# EAGLE design leds (EAGLE 9.4.2)
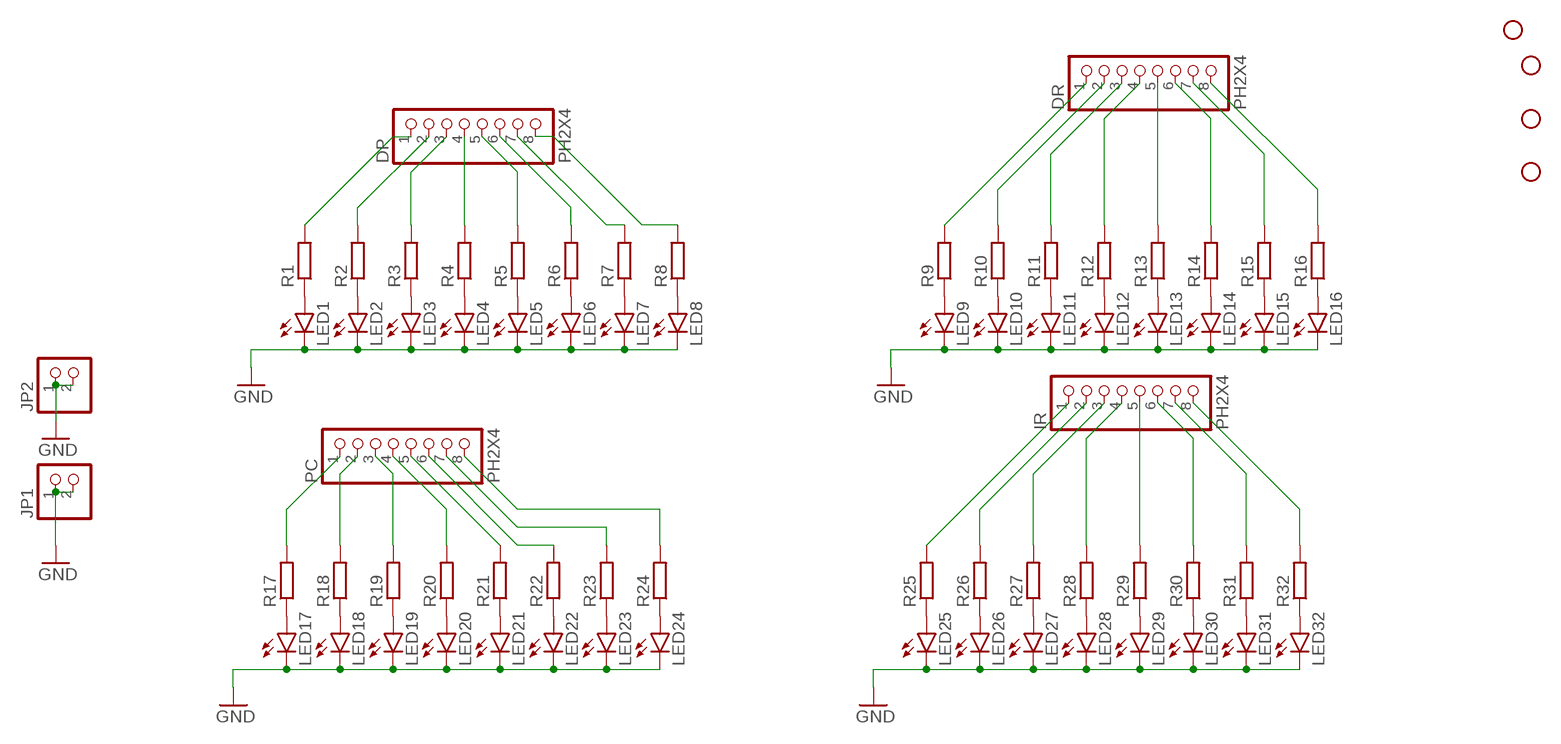
[diagram p0: schematic, sheet 1]

## Parts
DP  PH2X4  [2X04]
DR  PH2X4  [2X04]
H1  STAND-OFF  [STAND-OFF]
H2  STAND-OFF  [STAND-OFF]
H3  STAND-OFF  [STAND-OFF]
H4  STAND-OFF  [STAND-OFF]
IR  PH2X4  [2X04]
JP1  PINHD-1X2  [1X02]
JP2  PINHD-1X2  [1X02]
LED1  LED5MM  [LED5MM]
LED2  LED5MM  [LED5MM]
LED3  LED5MM  [LED5MM]
LED4  LED5MM  [LED5MM]
LED5  LED5MM  [LED5MM]
LED6  LED5MM  [LED5MM]
LED7  LED5MM  [LED5MM]
LED8  LED5MM  [LED5MM]
LED9  LED5MM  [LED5MM]
LED10  LED5MM  [LED5MM]
LED11  LED5MM  [LED5MM]
LED12  LED5MM  [LED5MM]
LED13  LED5MM  [LED5MM]
LED14  LED5MM  [LED5MM]
LED15  LED5MM  [LED5MM]
LED16  LED5MM  [LED5MM]
LED17  LED5MM  [LED5MM]
LED18  LED5MM  [LED5MM]
LED19  LED5MM  [LED5MM]
LED20  LED5MM  [LED5MM]
LED21  LED5MM  [LED5MM]
LED22  LED5MM  [LED5MM]
LED23  LED5MM  [LED5MM]
LED24  LED5MM  [LED5MM]
LED25  LED5MM  [LED5MM]
LED26  LED5MM  [LED5MM]
LED27  LED5MM  [LED5MM]
LED28  LED5MM  [LED5MM]
LED29  LED5MM  [LED5MM]
LED30  LED5MM  [LED5MM]
LED31  LED5MM  [LED5MM]
LED32  LED5MM  [LED5MM]
PC  PH2X4  [2X04]
R1  R-EU_0204/5  [0204/5]
R2  R-EU_0204/5  [0204/5]
R3  R-EU_0204/5  [0204/5]
R4  R-EU_0204/5  [0204/5]
R5  R-EU_0204/5  [0204/5]
R6  R-EU_0204/5  [0204/5]
R7  R-EU_0204/5  [0204/5]
R8  R-EU_0204/5  [0204/5]
R9  R-EU_0204/5  [0204/5]
R10  R-EU_0204/5  [0204/5]
R11  R-EU_0204/5  [0204/5]
R12  R-EU_0204/5  [0204/5]
R13  R-EU_0204/5  [0204/5]
R14  R-EU_0204/5  [0204/5]
R15  R-EU_0204/5  [0204/5]
R16  R-EU_0204/5  [0204/5]
R17  R-EU_0204/5  [0204/5]
R18  R-EU_0204/5  [0204/5]
R19  R-EU_0204/5  [0204/5]
R20  R-EU_0204/5  [0204/5]
R21  R-EU_0204/5  [0204/5]
R22  R-EU_0204/5  [0204/5]
R23  R-EU_0204/5  [0204/5]
R24  R-EU_0204/5  [0204/5]
R25  R-EU_0204/5  [0204/5]
R26  R-EU_0204/5  [0204/5]
R27  R-EU_0204/5  [0204/5]
R28  R-EU_0204/5  [0204/5]
R29  R-EU_0204/5  [0204/5]
R30  R-EU_0204/5  [0204/5]
R31  R-EU_0204/5  [0204/5]
R32  R-EU_0204/5  [0204/5]

## Nets
GND: JP1.1 JP1.2 JP2.1 JP2.2 LED1.K(C) LED2.K(C) LED3.K(C) LED4.K(C) LED5.K(C) LED6.K(C) LED7.K(C) LED8.K(C) LED9.K(C) LED10.K(C) LED11.K(C) LED12.K(C) LED13.K(C) LED14.K(C) LED15.K(C) LED16.K(C) LED17.K(C) LED18.K(C) LED19.K(C) LED20.K(C) LED21.K(C) LED22.K(C) LED23.K(C) LED24.K(C) LED25.K(C) LED26.K(C) LED27.K(C) LED28.K(C) LED29.K(C) LED30.K(C) LED31.K(C) LED32.K(C)
N$1: LED1.A R1.1
N$2: LED2.A R2.1
N$3: LED3.A R3.1
N$4: LED4.A R4.1
N$5: LED5.A R5.1
N$6: LED6.A R6.1
N$7: LED7.A R7.1
N$8: LED8.A R8.1
N$9: LED9.A R9.1
N$10: LED10.A R10.1
N$11: LED11.A R11.1
N$12: LED12.A R12.1
N$13: LED13.A R13.1
N$14: LED14.A R14.1
N$15: LED15.A R15.1
N$16: LED16.A R16.1
N$17: LED17.A R17.1
N$18: LED18.A R18.1
N$19: LED19.A R19.1
N$20: LED20.A R20.1
N$21: LED21.A R21.1
N$22: LED22.A R22.1
N$23: LED23.A R23.1
N$24: LED24.A R24.1
N$25: LED25.A R25.1
N$26: LED26.A R26.1
N$27: LED27.A R27.1
N$28: LED28.A R28.1
N$29: LED29.A R29.1
N$30: LED30.A R30.1
N$31: LED31.A R31.1
N$32: LED32.A R32.1
N$33: PC.1 R17.2
N$34: IR.1 R25.2
N$35: DR.1 R9.2
N$36: DP.1 R1.2
N$37: DP.2 R2.2
N$38: DP.3 R3.2
N$39: DP.4 R4.2
N$40: DP.5 R5.2
N$41: DP.6 R6.2
N$42: DP.7 R7.2
N$43: DP.8 R8.2
N$44: DR.2 R10.2
N$45: DR.3 R11.2
N$46: DR.4 R12.2
N$47: DR.5 R13.2
N$48: DR.6 R14.2
N$49: DR.7 R15.2
N$50: DR.8 R16.2
N$51: IR.2 R26.2
N$52: IR.3 R27.2
N$53: IR.4 R28.2
N$54: IR.5 R29.2
N$55: IR.6 R30.2
N$56: IR.7 R31.2
N$57: IR.8 R32.2
N$58: PC.2 R18.2
N$59: PC.3 R19.2
N$60: PC.4 R20.2
N$61: PC.5 R21.2
N$62: PC.6 R22.2
N$63: PC.7 R23.2
N$64: PC.8 R24.2

## Library data of the parts
DP DR IR PC = pinhead2:PH2X4
H1-H4 = SparkFun-Hardware:STAND-OFF: Stand Off Drill holes for mechanically mounting via screws, standoffs, etc. Note: Use the keepout ring to avoid running the screw head into surrounding components. Variant Overviews STAND-OFF - Mechanical footprint for a #4 phillips button head screw. STAND-OFF-TIGHT - Mechanical footprint for a #4 phillips button head screw, Example SparkFun Products Screw - Phillips Head (1/4", 4-40, 10 pack) <https://www.sparkfun.com/products/10453> (PRT-10453) Screw - Phillips Head (1/2", 4-40, 10 pack) <https://www.sparkfun.com/products/10452> (PRT-10452) Screw - Phillips Head (3/4", 4-40, 10 pack) <https://www.sparkfun.com/products/10451> (PRT-10451) Screw - Phillips Head (1", 4-40, 10 pack) <https://www.sparkfun.com/products/10450> (PRT-10450)
JP1 JP2 = pinhead:PINHD-1X2: PIN HEADER
LED1-LED32 = led:LED: LED OSRAM: - CHIPLED LG R971, LG N971, LY N971, LG Q971, LY Q971, LO R971, LY R971 LH N974, LH R974 LS Q976, LO Q976, LY Q976 LO Q996 - Hyper CHIPLED LW Q18S LB Q993, LB Q99A, LB R99A - SideLED LS A670, LO A670, LY A670, LG A670, LP A670 LB A673, LV A673, LT A673, LW A673 LH A674 LY A675 LS A676, LA A676, LO A676, LY A676, LW A676 LS A679, LY A679, LG A679 - Hyper Micro SIDELED® LS Y876, LA Y876, LO Y876, LY Y876 LT Y87S - SmartLED LW L88C, LW L88S LB L89C, LB L89S, LG L890 LS L89K, LO L89K, LY L89K LS L896, LA L896, LO L896, LY L896 - TOPLED LS T670, LO T670, LY T670, LG T670, LP T670 LSG T670, LSP T670, LSY T670, LOP T670, LYG T670 LG T671, LOG T671, LSG T671 LB T673, LV T673, LT T673, LW T673 LH T674 LS T676, LA T676, LO T676, LY T676, LB T676, LH T676, LSB T676, LW T676 LB T67C, LV T67C, LT T67C, LS T67K, LO T67K, LY T67K, LW E67C LS E67B, LA E67B, LO E67B, LY E67B, LB E67C, LV E67C, LT E67C LW T67C LS T679, LY T679, LG T679 LS T770, LO T770, LY T770, LG T770, LP T770 LB T773, LV T773, LT T773, LW T773 LH T774 LS E675, LA E675, LY E675, LS T675 LS T776, LA T776, LO T776, LY T776, LB T776 LHGB T686 LT T68C, LB T68C - Hyper Mini TOPLED® LB M676 - Mini TOPLED Santana® LG M470 LS M47K, LO M47K, LY M47K Source: http://www.osram.convergy.de LUXEON: - LUMILED® LXK2-PW12-R00, LXK2-PW12-S00, LXK2-PW14-U00, LXK2-PW14-V00 LXK2-PM12-R00, LXK2-PM12-S00, LXK2-PM14-U00 LXK2-PE12-Q00, LXK2-PE12-R00, LXK2-PE12-S00, LXK2-PE14-T00, LXK2-PE14-U00 LXK2-PB12-K00, LXK2-PB12-L00, LXK2-PB12-M00, LXK2-PB14-N00, LXK2-PB14-P00, LXK2-PB14-Q00 LXK2-PR12-L00, LXK2-PR12-M00, LXK2-PR14-Q00, LXK2-PR14-R00 LXK2-PD12-Q00, LXK2-PD12-R00, LXK2-PD12-S00 LXK2-PH12-R00, LXK2-PH12-S00 LXK2-PL12-P00, LXK2-PL12-Q00, LXK2-PL12-R00 Source: www.luxeon.com KINGBRIGHT: KA-3528ASYC Source: www.kingbright.com
R1-R32 = rcl:R-EU_: RESISTOR, European symbol; SPICEPREFIX: R

## Board
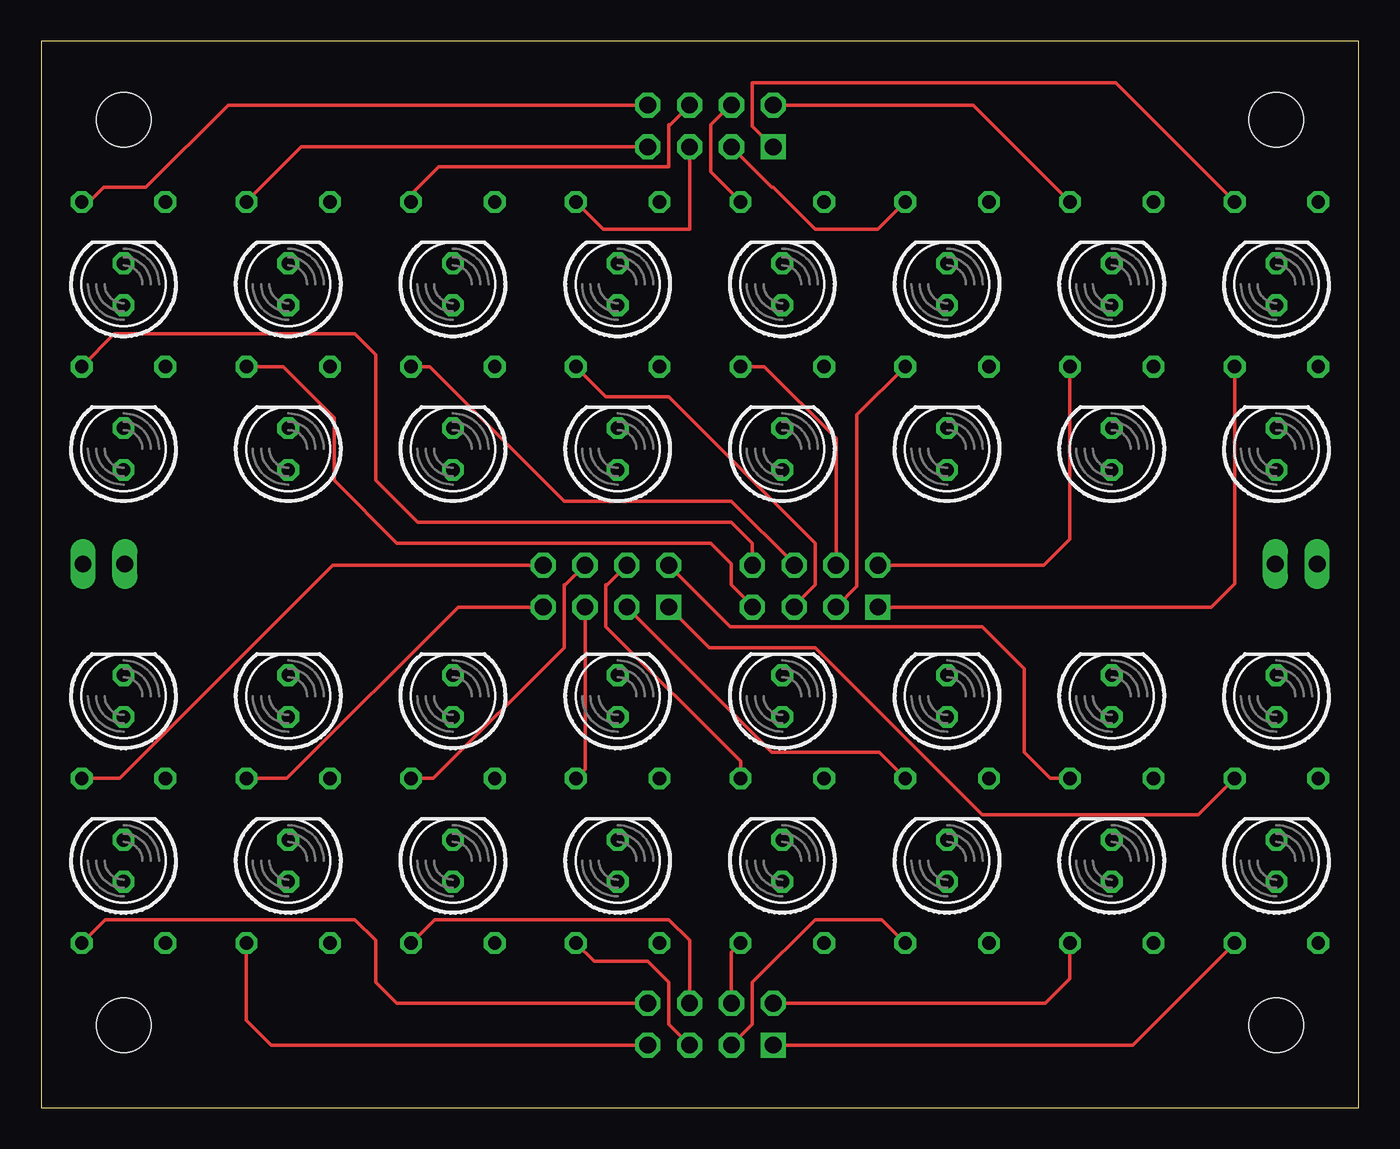
[diagram p1: board, top side]
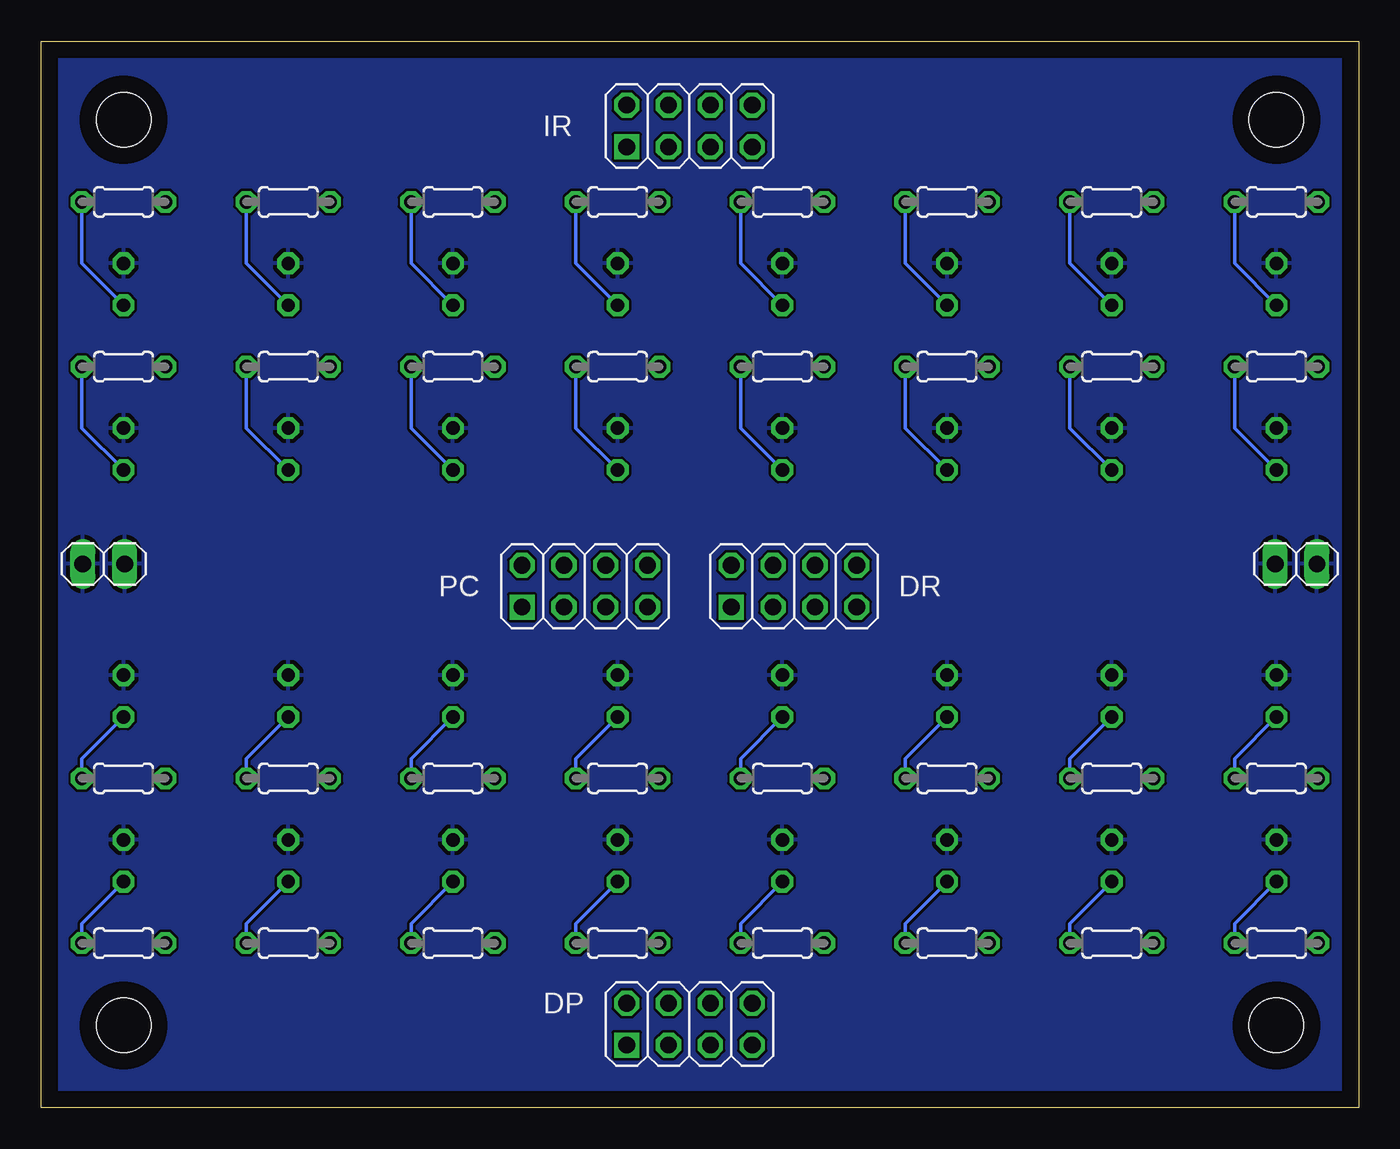
[diagram p2: board, bottom side, seen from below]

Size 80 x 64.76 mm. Coordinates in mm from the lower left corner, seen from the top.
Outline: 0,0 80,0 80,64.76 0,64.76 0,0
Copper layers (1*16): Top 0.035mm / dielectric 1.5mm / Bottom 0.035mm
Design rules "default *": minimum track width 8mil, minimum drill 0.35mm, track to track 6mil, track to pad 6mil, pad to pad 6mil, via to via 6mil, smd to smd 6mil, copper to edge 40mil, drill to drill 6mil, minimum pad ring 10mil, minimum via ring 8mil, stop-mask expansion 4mil, vias tented up to drill 0mil, thermal gap 10mil

### Footprints (pad centres in the part's own frame; a part is rotated, then mirrored left to right if it is on the bottom)
2X04 = drill 1.016 square: 1 -3.81,-1.27 | drill 1.016 octagon: 2 -3.81,1.27; 3 -1.27,-1.27; 4 -1.27,1.27; 5 1.27,-1.27; 6 1.27,1.27; 7 3.81,-1.27; 8 3.81,1.27
STAND-OFF = hole 3.302: 0,0
1X02 = drill 1.016 long: 1 -1.27,0; 2 1.27,0
LED5MM = drill 0.813 octagon: A -1.27,0; K 1.27,0
0204/5 = drill 0.813 octagon: 1 -2.54,0; 2 2.54,0

### Placement (x,y rotation side)
DP  40.64,5.08 0 bottom
DR  34.29,31.67 0 bottom
H1  5,5 0 top
H2  75,5 0 top
H3  5,60 0 top
H4  75,60 0 top
IR  40.64,59.61 0 bottom
JP1  3.81,33.02 0 bottom
JP2  76.2,33.02 0 bottom
LED1  75,15 90 top
LED2  65,15 90 top
LED3  55,15 90 top
LED4  45,15 90 top
LED5  35,15 90 top
LED6  25,15 90 top
LED7  15,15 90 top
LED8  5,15 90 top
LED9  75,25 90 top
LED10  65,25 90 top
LED11  55,25 90 top
LED12  45,25 90 top
LED13  35,25 90 top
LED14  25,25 90 top
LED15  15,25 90 top
LED16  5,25 90 top
LED17  75,40 90 top
LED18  65,40 90 top
LED19  55,40 90 top
LED20  45,40 90 top
LED21  35,40 90 top
LED22  25,40 90 top
LED23  15,40 90 top
LED24  5,40 90 top
LED25  75,50 90 top
LED26  65,50 90 top
LED27  55,50 90 top
LED28  45,50 90 top
LED29  35,50 90 top
LED30  25,50 90 top
LED31  15,50 90 top
LED32  5,50 90 top
PC  46.99,31.67 0 bottom
R1  75,10 0 bottom
R2  65,10 0 bottom
R3  55,10 0 bottom
R4  45,10 0 bottom
R5  35,10 0 bottom
R6  25,10 0 bottom
R7  15,10 0 bottom
R8  5,10 0 bottom
R9  75,20 0 bottom
R10  65,20 0 bottom
R11  55,20 0 bottom
R12  45,20 0 bottom
R13  35,20 0 bottom
R14  25,20 0 bottom
R15  15,20 0 bottom
R16  5,20 0 bottom
R17  75,45 0 bottom
R18  65,45 0 bottom
R19  55,45 0 bottom
R20  45,45 0 bottom
R21  35,45 0 bottom
R22  25,45 0 bottom
R23  15,45 0 bottom
R24  5,45 0 bottom
R25  75,55 0 bottom
R26  65,55 0 bottom
R27  55,55 0 bottom
R28  45,55 0 bottom
R29  35,55 0 bottom
R30  25,55 0 bottom
R31  15,55 0 bottom
R32  5,55 0 bottom

### Tracks (layer width: path | path; a pad name or v marks a point on that pad's centre or on a via)
GND
  pour Bottom: -1.27,67.31 82.55,67.31 82.55,-2.54 -1.27,-2.54
N$1
  Bottom 0.203: LED1.A 77.54,11.19 R1.1
N$2
  Bottom 0.203: LED2.A 67.54,11.19 R2.1
N$3
  Bottom 0.203: LED3.A 57.54,11.19 R3.1
N$4
  Bottom 0.203: LED4.A 47.54,11.19 R4.1
N$5
  Bottom 0.203: LED5.A 37.54,11.19 R5.1
N$6
  Bottom 0.203: LED6.A 27.54,11.19 R6.1
N$7
  Bottom 0.203: LED7.A 17.54,11.19 R7.1
N$8
  Bottom 0.203: LED8.A 7.54,11.19 R8.1
N$9
  Bottom 0.203: LED9.A 77.54,21.19 R9.1
N$10
  Bottom 0.203: LED10.A 67.54,21.19 R10.1
N$11
  Bottom 0.203: LED11.A 57.54,21.19 R11.1
N$12
  Bottom 0.203: LED12.A 47.54,21.19 R12.1
N$13
  Bottom 0.203: LED13.A 37.54,21.19 R13.1
N$14
  Bottom 0.203: LED14.A 27.54,21.19 R14.1
N$15
  Bottom 0.203: LED15.A 17.54,21.19 R15.1
N$16
  Bottom 0.203: LED16.A 7.54,21.19 R16.1
N$17
  Bottom 0.203: LED17.A 77.54,41.27 R17.1
N$18
  Bottom 0.203: LED18.A 67.54,41.27 R18.1
N$19
  Bottom 0.203: LED19.A 57.54,41.27 R19.1
N$20
  Bottom 0.203: LED20.A 47.54,41.27 R20.1
N$21
  Bottom 0.203: LED21.A 37.54,41.27 R21.1
N$22
  Bottom 0.203: LED22.A 27.54,41.27 R22.1
N$23
  Bottom 0.203: LED23.A 17.54,41.27 R23.1
N$24
  Bottom 0.203: LED24.A 7.54,41.27 R24.1
N$25
  Bottom 0.203: LED25.A 77.54,51.27 R25.1
N$26
  Bottom 0.203: LED26.A 67.54,51.27 R26.1
N$27
  Bottom 0.203: LED27.A 57.54,51.27 R27.1
N$28
  Bottom 0.203: LED28.A 47.54,51.27 R28.1
N$29
  Bottom 0.203: LED29.A 37.54,51.27 R29.1
N$30
  Bottom 0.203: LED30.A 27.54,51.27 R30.1
N$31
  Bottom 0.203: LED31.A 17.54,51.27 R31.1
N$32
  Bottom 0.203: LED32.A 7.54,51.27 R32.1
N$33
  Top 0.203: PC.1 71.04,30.4 72.46,31.82 R17.2
N$34
  Top 0.203: IR.1 43.18,59.61 43.18,62.23 65.23,62.23 R25.2
N$35
  Top 0.203: DR.1 40.56,27.94 46.99,27.94 57.15,17.78 70.24,17.78 R9.2
N$36
  Top 0.203: DP.1 66.27,3.81 R1.2
N$37
  Top 0.203: DP.2 60.96,6.35 62.46,7.85 R2.2
N$38
  Top 0.203: DP.3 43.18,5.08 43.18,7.62 46.99,11.43 51.03,11.43 R3.2
N$39
  Top 0.203: DP.4 41.91,9.45 R4.2
N$40
  Top 0.203: DP.5 38.1,5.08 38.1,7.62 36.83,8.89 33.57,8.89 R5.2
N$41
  Top 0.203: DP.6 39.37,10.16 38.1,11.43 23.89,11.43 R6.2
N$42
  Top 0.203: DP.7 13.97,3.81 12.46,5.32 R7.2
N$43
  Top 0.203: DP.8 21.59,6.35 20.32,7.62 20.32,10.16 19.05,11.43 3.89,11.43 R8.2
N$44
  Top 0.203: DR.2 41.83,29.21 57.15,29.21 59.69,26.67 59.69,21.59 61.28,20 R10.2
N$45
  Top 0.203: DR.3 44.37,21.59 50.87,21.59 R11.2
N$46
  Top 0.203: DR.4 34.37,31.75 34.29,31.75 34.29,29.21 42.46,21.04 R12.2
N$47
  Top 0.203: DR.5 33.02,20.56 R13.2
N$48
  Top 0.203: DR.6 31.83,31.75 31.75,31.75 31.75,27.94 23.81,20 R14.2
N$49
  Top 0.203: DR.7 25.32,30.4 14.92,20 R15.2
N$50
  Top 0.203: DR.8 17.7,32.94 4.76,20 R16.2
N$51
  Top 0.203: IR.2 56.58,60.88 R26.2
N$52
  Top 0.203: IR.3 44.37,55.88 44.45,55.88 46.99,53.34 50.8,53.34 R27.2
N$53
  Top 0.203: R28.2 40.64,56.82 40.64,59.69 41.83,60.88 IR.4
N$54
  Top 0.203: IR.5 39.37,53.34 34.12,53.34 R29.2
N$55
  Top 0.203: IR.6 38.18,59.69 38.1,59.69 38.1,57.15 24.13,57.15 22.46,55.48 R30.2
N$56
  Top 0.203: R31.2 15.8,58.34 IR.7
N$57
  Top 0.203: R32.2 2.93,55 3.81,55.88 6.35,55.88 11.35,60.88 IR.8
N$58
  Top 0.203: PC.2 60.88,32.94 62.46,34.52 R18.2
N$59
  Top 0.203: PC.3 49.53,31.67 49.53,42.07 R19.2
N$60
  Top 0.203: PC.4 48.26,40.64 43.9,45 R20.2
N$61
  Top 0.203: PC.5 45.72,30.48 46.99,31.75 46.99,34.29 38.1,43.18 34.28,43.18 R21.2
N$62
  Top 0.203: PC.6 45.72,33.02 41.91,36.83 31.75,36.83 23.58,45 R22.2
N$63
  Top 0.203: PC.7 43.18,30.48 41.91,31.75 41.91,33.02 40.64,34.29 21.59,34.29 17.78,38.1 17.78,41.91 14.69,45 R23.2
N$64
  Top 0.203: PC.8 43.18,34.29 41.91,35.56 22.86,35.56 20.32,38.1 20.32,45.72 19.05,46.99 4.45,46.99 R24.2